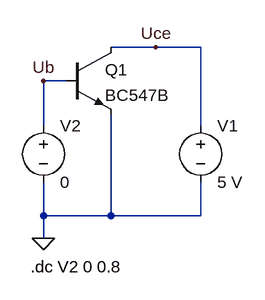
[diagram p0: schematic Draft1.asc]
Draft1.asc, the LTspice schematic file:
Version 4
SHEET 1 880 680
WIRE 560 -48 496 -48
WIRE 624 -48 560 -48
WIRE 432 0 400 0
WIRE 400 64 400 0
WIRE 624 64 624 -48
WIRE 400 192 400 144
WIRE 496 192 496 48
WIRE 496 192 400 192
WIRE 624 192 624 144
WIRE 624 192 496 192
WIRE 400 224 400 192
FLAG 400 224 0
FLAG 560 -48 Uce
FLAG 400 0 Ub
SYMBOL voltage 624 48 R0
SYMATTR InstName V1
SYMATTR Value 5 V
SYMBOL npn 432 -48 R0
SYMATTR InstName Q1
SYMATTR Value BC547B
SYMBOL voltage 400 48 R0
SYMATTR InstName V2
SYMATTR Value 0
TEXT 382 264 Left 2 !.dc V2 0 0.8

The netlist it stands for:
* Draft1.asc
V1 Uce 0 5 V
Q1 Uce Ub 0 0 BC547B
V2 Ub 0 0
.model NPN NPN
.model PNP PNP
.lib standard.bjt
.dc V2 0 0.8
.backanno
.end